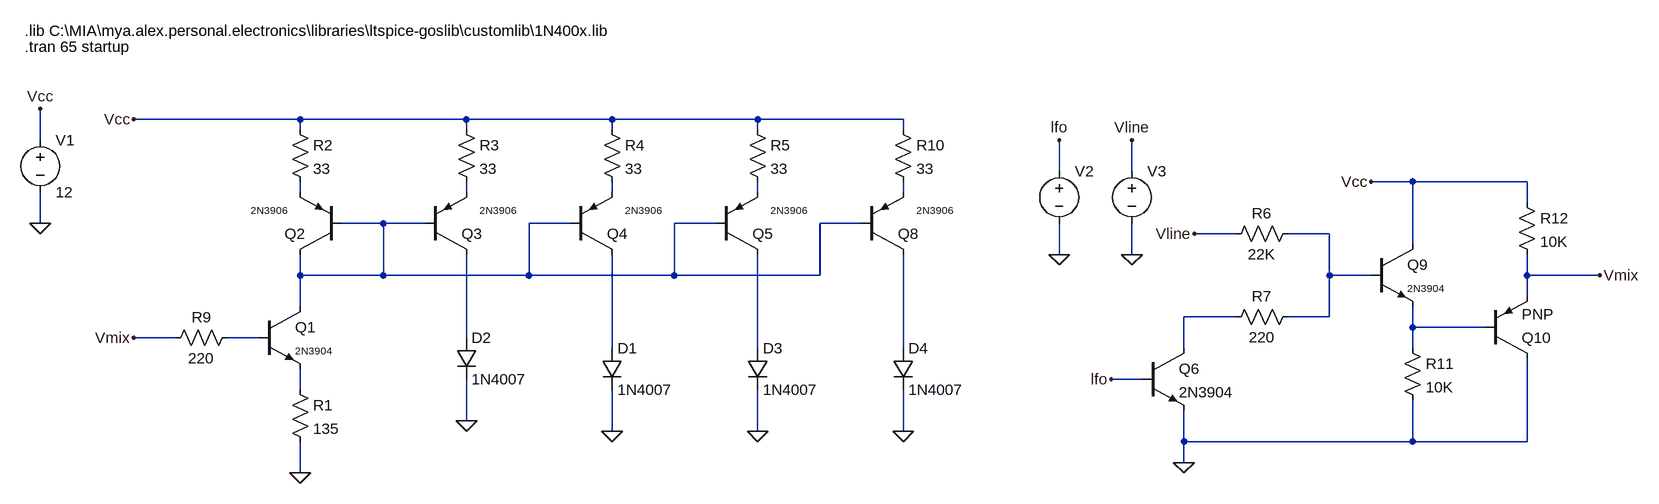
[diagram p0: schematic voltage-to-current-and-mirror.asc]
voltage-to-current-and-mirror.asc, the LTspice schematic file:
Version 4
SHEET 1 1076 740
WIRE -1632 16 -1888 16
WIRE -1376 16 -1632 16
WIRE -1152 16 -1376 16
WIRE -928 16 -1152 16
WIRE -704 16 -928 16
WIRE -1632 32 -1632 16
WIRE -1376 32 -1376 16
WIRE -1152 32 -1152 16
WIRE -928 32 -928 16
WIRE -704 32 -704 16
WIRE -2032 48 -2032 0
WIRE -464 96 -464 48
WIRE -352 96 -352 48
WIRE 80 112 16 112
WIRE 256 112 80 112
WIRE -1632 128 -1632 112
WIRE -1376 128 -1376 112
WIRE -1152 128 -1152 112
WIRE -928 128 -928 112
WIRE -704 128 -704 112
WIRE 256 144 256 112
WIRE -2032 176 -2032 128
WIRE -1504 176 -1568 176
WIRE -1440 176 -1504 176
WIRE -1216 176 -1280 176
WIRE -992 176 -1056 176
WIRE -768 176 -832 176
WIRE -192 192 -256 192
WIRE -48 192 -112 192
WIRE 80 208 80 112
WIRE -464 224 -464 176
WIRE -352 224 -352 176
WIRE -1632 256 -1632 224
WIRE -1504 256 -1504 176
WIRE -1504 256 -1632 256
WIRE -1280 256 -1280 176
WIRE -1280 256 -1504 256
WIRE -1056 256 -1056 176
WIRE -1056 256 -1280 256
WIRE -832 256 -832 176
WIRE -832 256 -1056 256
WIRE -48 256 -48 192
WIRE 16 256 -48 256
WIRE 256 256 256 224
WIRE 368 256 256 256
WIRE 256 288 256 256
WIRE -1632 304 -1632 256
WIRE -192 320 -272 320
WIRE -48 320 -48 256
WIRE -48 320 -112 320
WIRE 80 336 80 304
WIRE 192 336 80 336
WIRE -1824 352 -1888 352
WIRE -1696 352 -1744 352
WIRE -1376 352 -1376 224
WIRE -1152 368 -1152 224
WIRE -928 368 -928 224
WIRE -704 368 -704 224
WIRE -272 368 -272 320
WIRE 80 368 80 336
WIRE -336 416 -384 416
WIRE -1632 432 -1632 400
WIRE -1376 480 -1376 416
WIRE -1152 496 -1152 432
WIRE -928 496 -928 432
WIRE -704 496 -704 432
WIRE -272 512 -272 464
WIRE 80 512 80 448
WIRE 80 512 -272 512
WIRE 256 512 256 384
WIRE 256 512 80 512
WIRE -272 544 -272 512
WIRE -1632 560 -1632 512
FLAG -2032 176 0
FLAG -2032 0 Vcc
FLAG -464 224 0
FLAG -464 48 lfo
FLAG -352 224 0
FLAG -352 48 Vline
FLAG -256 192 Vline
FLAG -272 544 0
FLAG -384 416 lfo
FLAG -1632 560 0
FLAG -1888 16 Vcc
FLAG -928 496 0
FLAG -1152 496 0
FLAG -1376 480 0
FLAG -704 496 0
FLAG 16 112 Vcc
FLAG 368 256 Vmix
FLAG -1888 352 Vmix
SYMBOL voltage -2032 32 R0
WINDOW 123 0 0 Left 0
WINDOW 39 0 0 Left 0
SYMATTR InstName V1
SYMATTR Value 12
SYMBOL npn -1696 304 R0
WINDOW 3 56 68 Left 1
SYMATTR Value 2N3904
SYMATTR InstName Q1
SYMBOL pnp -1568 224 R180
WINDOW 3 84 68 Left 1
SYMATTR Value 2N3906
SYMATTR InstName Q2
SYMBOL res -1648 416 R0
SYMATTR InstName R1
SYMATTR Value 135
SYMBOL res -1648 16 R0
SYMATTR InstName R2
SYMATTR Value 33
SYMBOL pnp -1440 224 M180
WINDOW 3 84 68 Left 1
SYMATTR Value 2N3906
SYMATTR InstName Q3
SYMBOL res -1392 16 R0
SYMATTR InstName R3
SYMATTR Value 33
SYMBOL res -1168 16 R0
SYMATTR InstName R4
SYMATTR Value 33
SYMBOL pnp -1216 224 M180
WINDOW 3 84 68 Left 1
SYMATTR Value 2N3906
SYMATTR InstName Q4
SYMBOL res -944 16 R0
SYMATTR InstName R5
SYMATTR Value 33
SYMBOL pnp -992 224 M180
WINDOW 3 84 68 Left 1
SYMATTR Value 2N3906
SYMATTR InstName Q5
SYMBOL voltage -464 80 R0
WINDOW 123 0 0 Left 0
WINDOW 39 0 0 Left 0
WINDOW 3 24 96 Invisible 2
SYMATTR Value PULSE(0 .6V .05s 1u 1u 0.5s 1s)
SYMATTR InstName V2
SYMBOL voltage -352 80 R0
WINDOW 123 0 0 Left 0
WINDOW 39 0 0 Left 0
WINDOW 3 24 96 Invisible 2
SYMATTR Value PULSE(0 3.3 10s 5s 10s 35s 60s)
SYMATTR InstName V3
SYMBOL res -96 176 R90
WINDOW 0 0 56 VBottom 2
WINDOW 3 32 56 VTop 2
SYMATTR InstName R6
SYMATTR Value 22K
SYMBOL res -96 304 R90
WINDOW 0 0 56 VBottom 2
WINDOW 3 32 56 VTop 2
SYMATTR InstName R7
SYMATTR Value 220
SYMBOL npn -336 368 R0
SYMATTR InstName Q6
SYMATTR Value 2N3904
SYMBOL diode -944 368 R0
SYMATTR InstName D3
SYMATTR Value 1N4007
SYMBOL res -1728 336 R90
WINDOW 0 0 56 VBottom 2
WINDOW 3 32 56 VTop 2
SYMATTR InstName R9
SYMATTR Value 220
SYMBOL diode -1168 368 R0
SYMATTR InstName D1
SYMATTR Value 1N4007
SYMBOL diode -1392 352 R0
SYMATTR InstName D2
SYMATTR Value 1N4007
SYMBOL res -720 16 R0
SYMATTR InstName R10
SYMATTR Value 33
SYMBOL pnp -768 224 M180
WINDOW 3 84 68 Left 1
SYMATTR Value 2N3906
SYMATTR InstName Q8
SYMBOL diode -720 368 R0
SYMATTR InstName D4
SYMATTR Value 1N4007
SYMBOL npn 16 208 R0
WINDOW 3 56 68 Left 1
SYMATTR Value 2N3904
SYMATTR InstName Q9
SYMBOL res 64 352 R0
SYMATTR InstName R11
SYMATTR Value 10K
SYMBOL pnp 192 384 M180
SYMATTR InstName Q10
SYMBOL res 240 128 R0
SYMATTR InstName R12
SYMATTR Value 10K
TEXT -2056 -96 Left 2 !.tran 65 startup
TEXT -2056 -120 Left 2 !.lib C:\\MIA\\mya.alex.personal.electronics\\libraries\\ltspice-goslib\\customlib\\1N400x.lib

The netlist it stands for:
* voltage-to-current-and-mirror.asc
V1 Vcc 0 12
Q1 N006 N010 N015 0 2N3904
Q2 N006 N006 N001 0 2N3906
R1 N015 0 135
R2 Vcc N001 33
Q3 N011 N006 N002 0 2N3906
R3 Vcc N002 33
R4 Vcc N003 33
Q4 N012 N006 N003 0 2N3906
R5 Vcc N004 33
Q5 N013 N006 N004 0 2N3906
V2 lfo 0 PULSE(0 .6V .05s 1u 1u 0.5s 1s)
V3 Vline 0 PULSE(0 3.3 10s 5s 10s 35s 60s)
R6 N007 Vline 22K
R7 N007 N008 220
Q6 N008 lfo 0 0 2N3904
D3 N013 0 1N4007
R9 N010 Vmix 220
D1 N012 0 1N4007
D2 N011 0 1N4007
R10 Vcc N005 33
Q8 N014 N006 N005 0 2N3906
D4 N014 0 1N4007
Q9 Vcc N007 N009 0 2N3904
R11 N009 0 10K
Q10 0 N009 Vmix 0 PNP
R12 Vcc Vmix 10K
.model D D
.lib standard.dio
.model NPN NPN
.model PNP PNP
.lib standard.bjt
.tran 65 startup
.lib C:\MIA\mya.alex.personal.electronics\libraries\ltspice-goslib\customlib\1N400x.lib
.backanno
.end